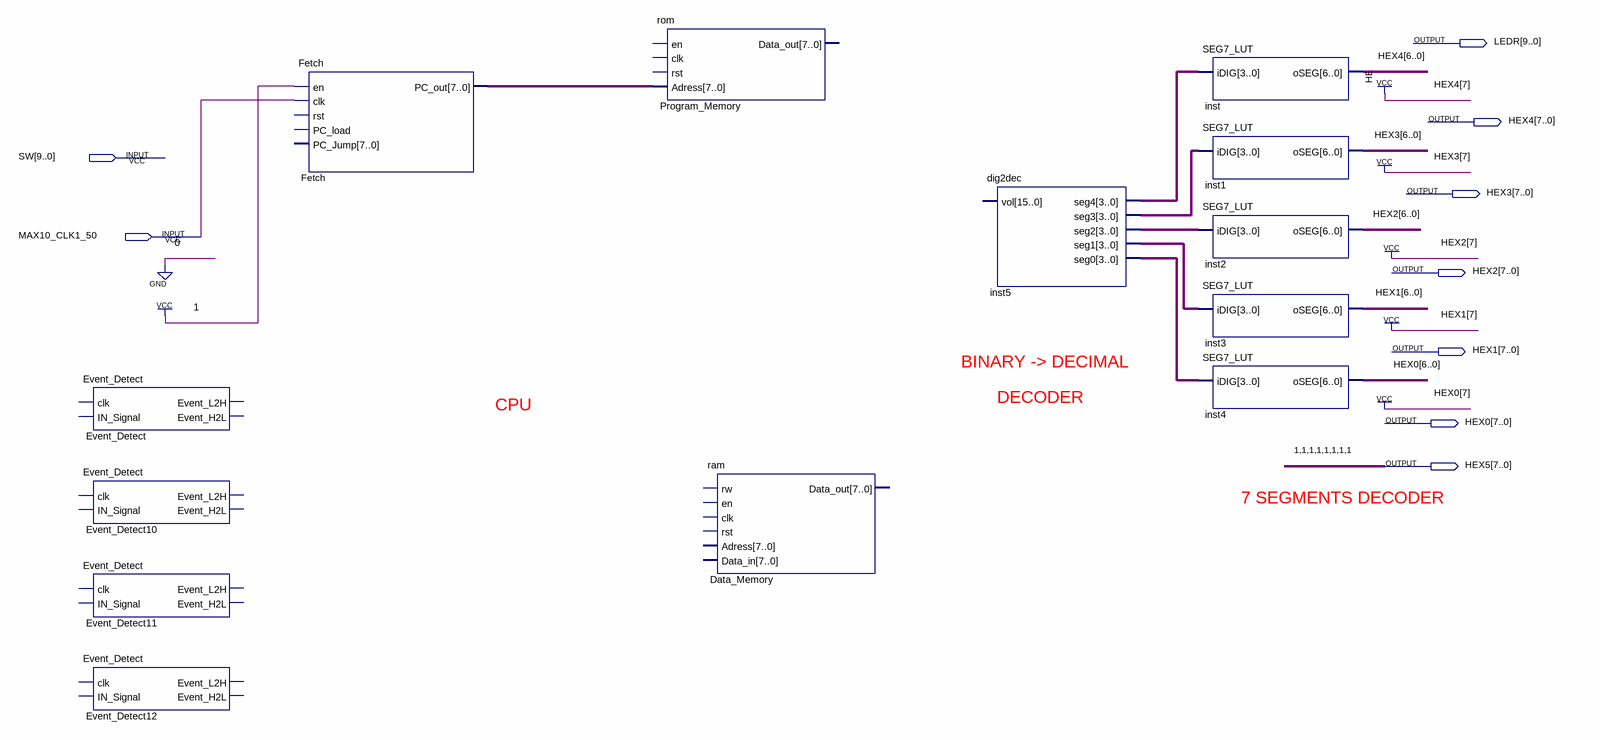
[diagram p0: schematic sheet]
// Quartus schematic CPU.bdf as structural Verilog: 13 symbols, 9 pins
module CPU (
  input  [9:0] SW,
  input  MAX10_CLK1_50,
  output [9:0] LEDR,
  output [7:0] HEX4,
  output [7:0] HEX3,
  output [7:0] HEX2,
  output [7:0] HEX1,
  output [7:0] HEX0,
  output [7:0] HEX5
);

  wire [3:0] inst5_seg0, inst5_seg1, inst5_seg2, inst5_seg3, inst5_seg4;
  wire [7:0] Fetch_pc_out;

  Event_Detect Event_Detect ();  // open: clk, IN_Signal, Event_L2H, Event_H2L
  Event_Detect Event_Detect10 ();  // open: clk, IN_Signal, Event_L2H, Event_H2L
  Event_Detect Event_Detect11 ();  // open: clk, IN_Signal, Event_L2H, Event_H2L
  Event_Detect Event_Detect12 ();  // open: clk, IN_Signal, Event_L2H, Event_H2L
  Fetch Fetch (.en(1'b1), .clk(MAX10_CLK1_50), .PC_out(Fetch_pc_out));  // open: rst, PC_load, PC_Jump
  rom Program_Memory (.Adress(Fetch_pc_out));  // open: en, clk, rst, Data_out
  ram Data_Memory ();  // open: rw, en, clk, rst, Adress, Data_in, Data_out
  dig2dec inst5 (
    .seg4(inst5_seg4), .seg3(inst5_seg3), .seg2(inst5_seg2), .seg1(inst5_seg1), .seg0(inst5_seg0));  // open: vol
  SEG7_LUT inst (.iDIG(inst5_seg4), .oSEG(HEX4[6:0]));
  SEG7_LUT inst1 (.iDIG(inst5_seg3), .oSEG(HEX3[6:0]));
  SEG7_LUT inst2 (.iDIG(inst5_seg2), .oSEG(HEX2[6:0]));
  SEG7_LUT inst3 (.iDIG(inst5_seg1), .oSEG(HEX1[6:0]));
  SEG7_LUT inst4 (.iDIG(inst5_seg0), .oSEG(HEX0[6:0]));

  assign HEX0[7] = 1'b1;
  assign HEX1[7] = 1'b1;
  assign HEX2[7] = 1'b1;
  assign HEX3[7] = 1'b1;
  assign HEX4[7] = 1'b1;
  assign HEX5 = {8{1'b1}};

  // Notes on the sheet:
  //   BINARY -> DECIMAL
  //   DECODER
  //   CPU
  //   7 SEGMENTS DECODER
endmodule
